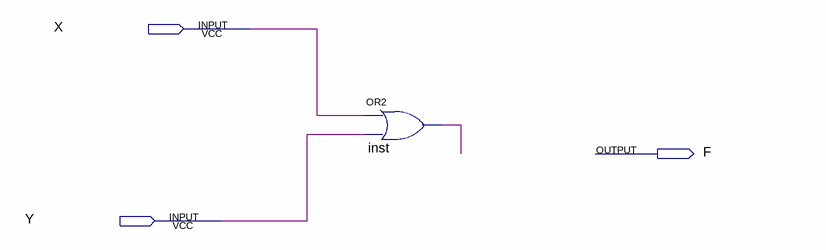
[diagram p0: schematic sheet]
// Quartus schematic orr.bdf as structural Verilog: 1 symbols, 3 pins
module orr (
  input  X,
  input  Y,
  output F
);

  wire inst_out;

  or inst (inst_out, X, Y);
endmodule
